# EAGLE design poe (EAGLE 6.5.0)
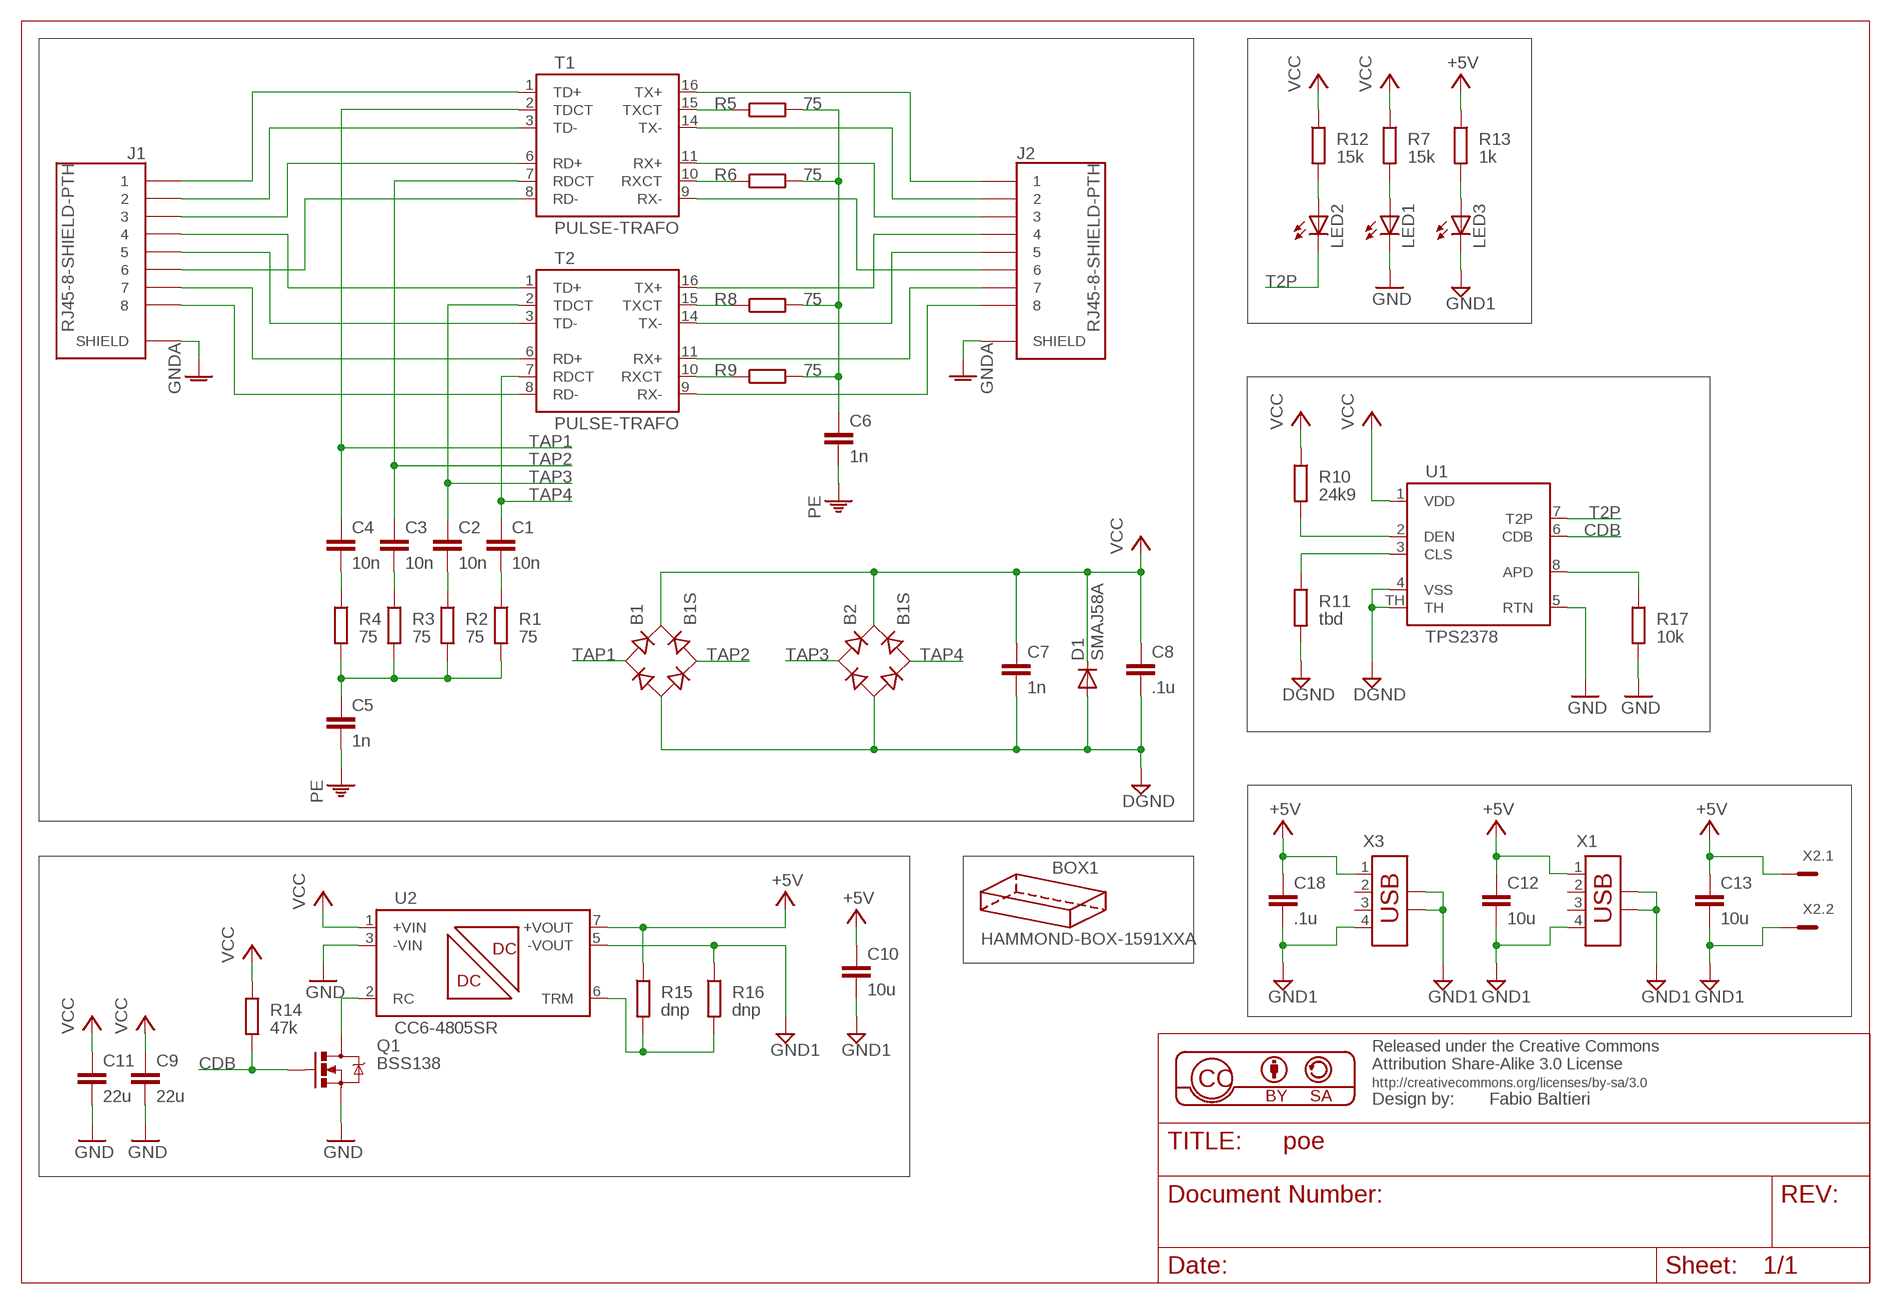
[diagram p0: schematic, sheet 1]

## Parts
B1  B1S  [MBS]
B2  B1S  [MBS]
BOX1  HAMMOND-BOX-1591XXA  [1591XXA]
C1  10n  C-EUC0603  [C0603]
C2  10n  C-EUC0603  [C0603]
C3  10n  C-EUC0603  [C0603]
C4  10n  C-EUC0603  [C0603]
C5  1n  C-EUC0603  [C0603]
C6  1n  C-EUC0603  [C0603]
C7  1n  C-EUC0603  [C0603]
C8  .1u  C-EUC0603  [C0603]
C9  22u  C-EUC1206  [C1206]
C10  10u  C-EUC0805  [C0805]
C11  22u  C-EUC1206  [C1206]
C12  10u  C-EUC0603  [C0603]
C13  10u  C-EUC0603  [C0603]
C18  .1u  C-EUC0603  [C0603]
D1  SMAJ58A  DIODESMA  [SMA-DIODE]
J1  RJ45-8-SHIELD-PTH  [RJ45-8-SHIELD]
J2  RJ45-8-SHIELD-PTH  [RJ45-8-SHIELD]
LED1  LEDSML0805  [SML0805]
LED2  LEDSML0805  [SML0805]
LED3  LEDSML0805  [SML0805]
Q1  BSS138  BSS138TRANS-00830  [SOT23-3]
R1  75  R-EU_R0603  [R0603]
R2  75  R-EU_R0603  [R0603]
R3  75  R-EU_R0603  [R0603]
R4  75  R-EU_R0603  [R0603]
R5  75  R-EU_R0603  [R0603]
R6  75  R-EU_R0603  [R0603]
R7  15k  R-EU_R0603  [R0603]
R8  75  R-EU_R0603  [R0603]
R9  75  R-EU_R0603  [R0603]
R10  24k9  R-EU_R0603  [R0603]
R11  tbd  R-EU_R0603  [R0603]
R12  15k  R-EU_R0603  [R0603]
R13  1k  R-EU_R0603  [R0603]
R14  47k  R-EU_R0603  [R0603]
R15  dnp  R-EU_R0603  [R0603]
R16  dnp  R-EU_R0603  [R0603]
R17  10k  R-EU_R0603  [R0603]
T1  PULSE-TRAFO  [PULSE-TRAFO]
T2  PULSE-TRAFO  [PULSE-TRAFO]
U1  TPS2378  [SOIC8-POWERPAD]
U2  CC6-4805SR  [CC6-XXXXSR-E]
X1  USB-787616  [USB]
X2  MC2  [MC2]
X3  USB-787616  [USB]

## Nets
+5V: C10.1 C12.1 C13.1 C18.1 R13.1 R15.1 U2.7(+VOUT) X1.1 X2.1 X3.1
CDB: Q1.1(G) R14.2 U1.6(CDB)
DGND: B1.- B2.- C7.2 C8.2 D1.A R11.2 U1.4(VSS) U1.TH
GND: C9.2 C11.2 LED1.C Q1.2(S) R17.2 U1.5(RTN) U2.3(-VIN)
GND1: C10.2 C12.2 C13.2 C18.2 LED3.C R16.1 U2.5(-VOUT) X1.4 X1.SHLD1 X1.SHLD2 X2.2 X3.4 X3.SHLD1 X3.SHLD2
GNDA: J1.P$1(SHIELD) J1.P$2(SHIELD) J2.P$1(SHIELD) J2.P$2(SHIELD)
N$1: LED1.A R7.2
N$2: LED2.A R12.2
N$3: R10.2 U1.2(DEN)
N$4: R11.1 U1.3(CLS)
N$5: J1.1 T1.1(TD+)
N$6: J1.2 T1.3(TD-)
N$7: J1.3 T1.6(RD+)
N$8: J1.6 T1.8(RD-)
N$9: J1.4 T2.1(TD+)
N$10: J1.5 T2.3(TD-)
N$11: J1.7 T2.6(RD+)
N$12: J1.8 T2.8(RD-)
N$13: C4.2 R4.1
N$14: C3.2 R3.1
N$15: C2.2 R2.1
N$16: C1.2 R1.1
N$17: C5.1 R1.2 R2.2 R3.2 R4.2
N$18: R5.1 T1.15(TXCT)
N$19: R6.1 T1.10(RXCT)
N$20: R8.1 T2.15(TXCT)
N$21: R9.1 T2.10(RXCT)
N$22: C6.1 R5.2 R6.2 R8.2 R9.2
N$23: J2.1 T1.16(TX+)
N$24: J2.2 T1.14(TX-)
N$25: J2.3 T1.11(RX+)
N$26: J2.6 T1.9(RX-)
N$27: J2.4 T2.16(TX+)
N$28: J2.5 T2.14(TX-)
N$29: J2.7 T2.11(RX+)
N$30: J2.8 T2.9(RX-)
N$31: LED3.A R13.2
N$32: Q1.3(D) U2.2(RC)
N$33: R15.2 R16.2 U2.6(TRM)
N$34: R17.1 U1.8(APD)
PE: C5.2 C6.2
T2P: LED2.C U1.7(T2P)
TAP1: B1.AC1 C4.1 T1.2(TDCT)
TAP2: B1.AC2 C3.1 T1.7(RDCT)
TAP3: B2.AC1 C2.1 T2.2(TDCT)
TAP4: B2.AC2 C1.1 T2.7(RDCT)
VCC: B1.+ B2.+ C7.1 C8.1 C9.1 C11.1 D1.C R7.1 R10.1 R12.1 R14.1 U1.1(VDD) U2.1(+VIN)
Unconnected: X1.2 X1.3 X3.2 X3.3

## Library data of the parts
B1 B2 = rectifier:B*S: Surface Mount Glass Passivated Bridge Rectifiers Source: Comchip Bridge Rectifiers B05S-G_B10S-G.pdf
BOX1 = hammond:HAMMOND-BOX: Hammond Project boxes Hammond 1551 Transluscent Blue 50x35x20mm 1551GTBU http://www.hammondmfg.com/pdf/1551G.pdf Hammond 1551 Transluscent Blue 50x50x20mm 1551RTBU http://www.hammondmfg.com/pdf/1551R.pdf Hammond 1551 Transluscent Blue 60x35x20mm 1551HTBU http://www.hammondmfg.com/pdf/1551H.pdf Hammond 1551 Transluscent Blue 80x40x20mm 1551KTBU http://www.hammondmfg.com/pdf/1551K.pdf Hammond 1591 Transluscent Blue 100x51x22m m 1591XXATBU http://www.hammondmfg.com/pdf/1591XXA.pdf
C1-C13 C18 = rcl:C-EU: CAPACITOR, European symbol
D1 = SparkFun-DiscreteSemi:DIODE: Diode These are standard reverse protection diodes and small signal diodes. SMA package can handle up to about 1A. SOD-323 can handle about 200mA. What the SOD-323 package when ordering, there are some mfgs out there that are 5-pin packages.
J1 J2 = balto:RJ45-8-SHIELD
LED1-LED3 = led:LED: LED OSRAM: - CHIPLED LG R971, LG N971, LY N971, LG Q971, LY Q971, LO R971, LY R971 LH N974, LH R974 LS Q976, LO Q976, LY Q976 LO Q996 - Hyper CHIPLED LW Q18S LB Q993, LB Q99A, LB R99A - SideLED LS A670, LO A670, LY A670, LG A670, LP A670 LB A673, LV A673, LT A673, LW A673 LH A674 LY A675 LS A676, LA A676, LO A676, LY A676, LW A676 LS A679, LY A679, LG A679 - Hyper Micro SIDELED® LS Y876, LA Y876, LO Y876, LY Y876 LT Y87S - SmartLED LW L88C, LW L88S LB L89C, LB L89S, LG L890 LS L89K, LO L89K, LY L89K LS L896, LA L896, LO L896, LY L896 - TOPLED LS T670, LO T670, LY T670, LG T670, LP T670 LSG T670, LSP T670, LSY T670, LOP T670, LYG T670 LG T671, LOG T671, LSG T671 LB T673, LV T673, LT T673, LW T673 LH T674 LS T676, LA T676, LO T676, LY T676, LB T676, LH T676, LSB T676, LW T676 LB T67C, LV T67C, LT T67C, LS T67K, LO T67K, LY T67K, LW E67C LS E67B, LA E67B, LO E67B, LY E67B, LB E67C, LV E67C, LT E67C LW T67C LS T679, LY T679, LG T679 LS T770, LO T770, LY T770, LG T770, LP T770 LB T773, LV T773, LT T773, LW T773 LH T774 LS E675, LA E675, LY E675, LS T675 LS T776, LA T776, LO T776, LY T776, LB T776 LHGB T686 LT T68C, LB T68C - Hyper Mini TOPLED® LB M676 - Mini TOPLED Santana® LG M470 LS M47K, LO M47K, LY M47K Source: http://www.osram.convergy.de LUXEON: - LUMILED® LXK2-PW12-R00, LXK2-PW12-S00, LXK2-PW14-U00, LXK2-PW14-V00 LXK2-PM12-R00, LXK2-PM12-S00, LXK2-PM14-U00 LXK2-PE12-Q00, LXK2-PE12-R00, LXK2-PE12-S00, LXK2-PE14-T00, LXK2-PE14-U00 LXK2-PB12-K00, LXK2-PB12-L00, LXK2-PB12-M00, LXK2-PB14-N00, LXK2-PB14-P00, LXK2-PB14-Q00 LXK2-PR12-L00, LXK2-PR12-M00, LXK2-PR14-Q00, LXK2-PR14-R00 LXK2-PD12-Q00, LXK2-PD12-R00, LXK2-PD12-S00 LXK2-PH12-R00, LXK2-PH12-S00 LXK2-PL12-P00, LXK2-PL12-Q00, LXK2-PL12-R00 Source: www.luxeon.com KINGBRIGHT: KA-3528ASYC Source: www.kingbright.com
Q1 = SparkFun-DiscreteSemi:BSS138: NMOSFET, Enh Mode 50V/6-ohm 200mA (SOT-23) TRANS-00830; PROD_ID: TRANS-00830
R1-R17 = rcl:R-EU_: RESISTOR, European symbol
T1 T2 = balto:PULSE-TRAFO: Pulse Transformer
U1 = balto:TPS2378: IEEE 802.3at PoE High-Power PD Interface
U2 = balto:CC6: DC-DC CONVERTER UNIT CC6-xxxxxR-E Series
X1 X3 = balto:USB-787616: AMP connector
X2 = con-phoenix-381_l:MC2: Mini-Combicon 3.81mm horizontal 2-polig MC 1,5/2-G-3,81 Artikel-Nr. 1803277

## Board
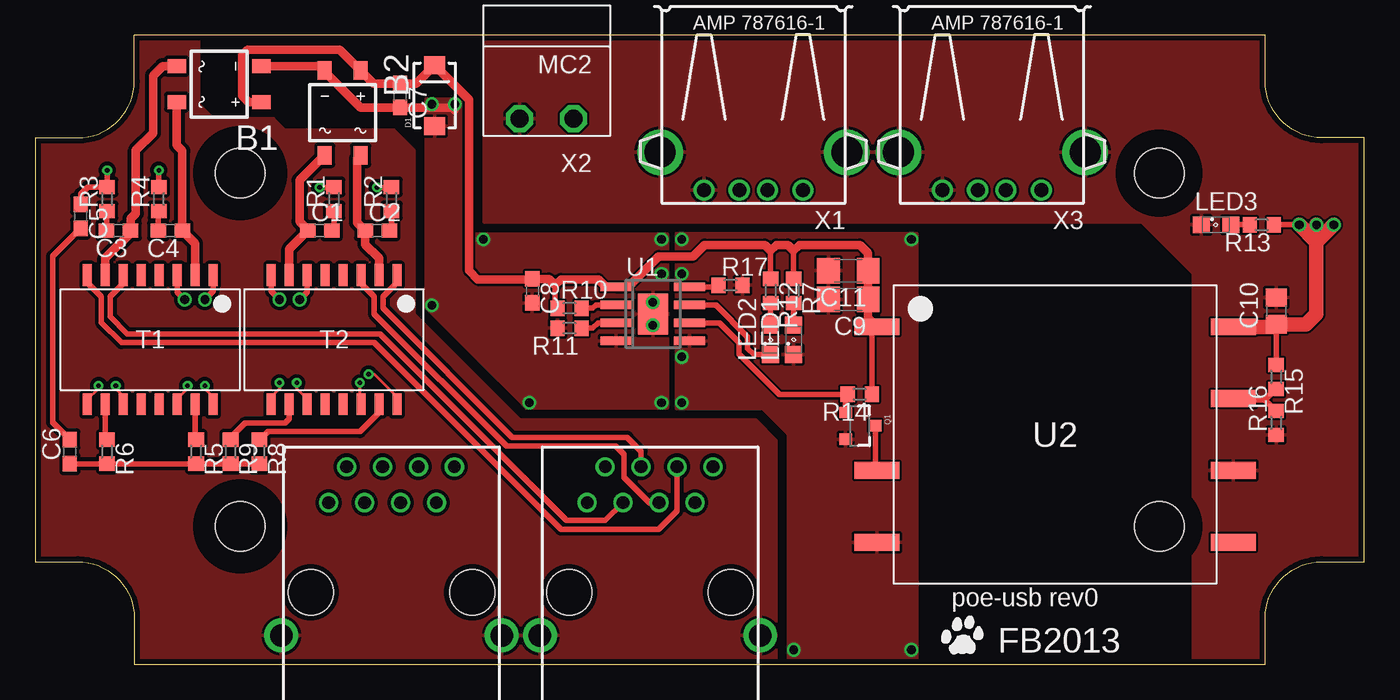
[diagram p1: board, top side]
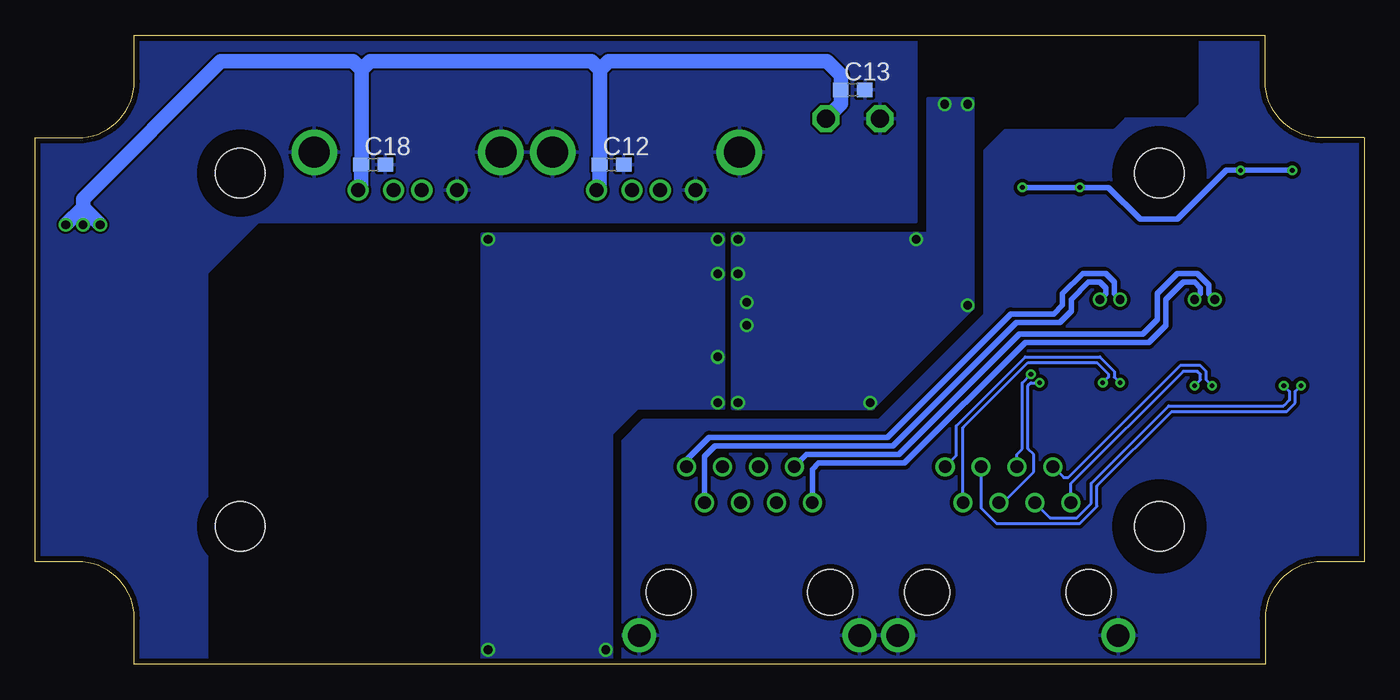
[diagram p2: board, bottom side, seen from below]

Size 94 x 44.5 mm. Coordinates in mm from the lower left corner, seen from the top.
Copper layers (1*16): Top 0.035mm / dielectric 1.5mm / Bottom 0.035mm
Design rules "balto": minimum track width 6mil, minimum drill 13mil, track to track 6mil, track to pad 6mil, pad to pad 6mil, via to via 6mil, smd to smd 6mil, copper to edge 15mil, drill to drill 6mil, minimum pad ring 7mil, minimum via ring 7mil, stop-mask expansion 2mil, vias tented up to drill 20mil, thermal gap 8mil

### Footprints (pad centres in the part's own frame; a part is rotated, then mirrored left to right if it is on the bottom)
MBS = smd 1 x 1.3: + -1.27,-3; - 1.27,-3; AC1 -1.27,3; AC2 1.27,3
1591XXA = hole 3.5: 79.5,9.75; 14.5,34.75; 79.5,34.75; 14.5,9.75
C0603 = smd 1.1 x 1: 1 -0.85,0; 2 0.85,0
C1206 = smd 1.6 x 1.8: 1 -1.4,0; 2 1.4,0
C0805 = smd 1.3 x 1.5: 1 -0.95,0; 2 0.95,0
SMA-DIODE = smd 1.27 x 1.47: A -2.15,0; C 2.15,0
RJ45-8-SHIELD = drill 0.9: 1 -4.445,6.35; 2 -3.175,8.89; 3 -1.905,6.35; 4 -0.635,8.89; 5 0.635,6.35; 6 1.905,8.89; 7 3.175,6.35; 8 4.445,8.89 | drill 1.6: P$1 7.795,-3.05; P$2 -7.795,-3.05 | hole 3.2: -5.715,0; 5.715,0
SML0805 = smd 1.2 x 1.2: A 1.05,0; C -1.05,0
SOT23-3 = smd 0.8 x 0.9: 1 -0.95,-1; 2 0.95,-1; 3 0,1.1
R0603 = smd 1 x 1.1: 1 -0.85,0; 2 0.85,0
PULSE-TRAFO = smd 0.64 x 1.525: 1 -4.445,-4.572; 2 -3.175,-4.572; 3 -1.905,-4.572; 4 -0.635,-4.572; 5 0.635,-4.572; 6 1.905,-4.572; 7 3.175,-4.572; 8 4.445,-4.572; 9 4.445,4.572; 10 3.175,4.572; 11 1.905,4.572; 12 0.635,4.572; 13 -0.635,4.572; 14 -1.905,4.572; 15 -3.175,4.572; 16 -4.445,4.572
SOIC8-POWERPAD = smd 0.6 x 2.2: 1 -1.905,-2.6; 2 -0.635,-2.6; 3 0.635,-2.6; 4 1.905,-2.6; 5 1.905,2.6; 6 0.635,2.6; 7 -0.635,2.6; 8 -1.905,2.6 | smd 2.9 x 2.1: TH 0,0
CC6-XXXXSR-E = smd 3.2 x 1.2: 1 -12.6,7.62; 2 -12.6,-2.54; 3 -12.6,-7.62; 4 12.6,-7.62; 5 12.6,-2.54; 6 12.6,2.54; 7 12.6,7.62
USB = drill 1: 1 -3.5,12.99; 2 -1,12.99; 3 1,12.99; 4 3.5,12.99 | drill 2.2: SHLD1 -6.6,10.3; SHLD2 6.6,10.3
MC2 = drill 1.27 octagon: 1 -1.905,0; 2 1.905,0

### Placement (x,y rotation side)
B1  13,41.05 90 top
B2  21.74,39.01 180 top
BOX1  0,0 0 top
C1  20.12,30.68 0 top
C2  24.18,30.68 0 top
C3  5.89,30.68 180 top
C4  9.55,30.68 180 top
C5  3.2,31.7 270 top
C6  2.44,15.04 90 top
C7  25.81,40.23 270 top
C8  35.15,26.42 270 top
C9  57.51,25.81 180 top
C10  87.78,24.99 90 top
C11  57.51,27.84 180 top
C12  53.24,35.36 0 bottom
C13  36.17,40.64 0 bottom
C18  70.1,35.36 0 bottom
D1  28.24,40.23 90 top
J1  43.48,5.08 0 top
J2  25.2,5.08 0 top
LED1  53.64,22.96 90 top
LED2  52.02,22.96 90 top
LED3  83.52,31.09 0 top
Q1  58.32,16.87 270 top
R1  21.13,32.92 90 top
R2  25.2,32.92 90 top
R3  5.08,32.92 90 top
R4  8.74,32.92 90 top
R5  11.38,15.04 270 top
R6  5.08,15.04 270 top
R7  53.64,26.42 270 top
R8  15.85,15.04 270 top
R9  13.82,15.04 270 top
R10  37.8,25.2 0 top
R11  37.8,23.77 180 top
R12  52.02,26.42 270 top
R13  86.77,31.09 180 top
R14  58.32,19.1 180 top
R15  87.78,20.32 270 top
R16  87.78,17.07 90 top
R17  49.17,26.82 0 top
T1  8.13,22.96 180 top
T2  21.13,22.96 180 top
U1  43.69,24.79 270 top
U2  72.14,16.26 0 top
U$2  [CAT-L]  65.63,1.63 0 top
X1  50.8,46.53 180 top
X2  36.17,38.61 180 top
X3  67.67,46.53 180 top

### Tracks (layer width: path | path; a pad name or v marks a point on that pad's centre or on a via)
+5V  (via drill 0.61)
  Top 0.406: R15.1 C10.1 | v89.41,31.09 R13.1
  Top 1.016: v89.41,31.09 90.63,29.87 | v90.63,31.09 90.63,29.87 | v91.85,31.09 90.63,29.87 | U2.7 87.61,23.88 C10.1 89.88,24.04 90.63,24.79 90.63,29.87
  Bottom 1.016: X2.1 37.02,39.66 C13.1 37.02,41.69 38,42.67 53.44,42.67 54.05,42.06 | 54.05,42.06 54.66,42.67 70.31,42.67 70.92,42.06 | 70.92,42.06 71.53,42.67 80.87,42.67 90.63,32.92 90.63,32.31 | 54.05,42.06 54.05,35.39 C12.1 54.09,33.75 X1.1 | 70.92,42.06 70.92,35.39 C18.1 70.95,33.75 X3.1 | 90.63,32.31 v90.63,31.09 | v89.41,31.09 90.63,32.31 | 90.63,32.31 v91.85,31.09
CDB
  Top 0.406: Q1.1 57.32,18.95 R14.2 52.63,19.1 49.78,21.95 49.78,22.76 48.39,24.16 U1.6
DGND  (via drill 0.61)
  Top 0.61: B1.- 20.17,42.32 B2.- 20.47,41.91 23,39.38 C7.2 29.5,39.38 29.67,39.22
  other vias: 44.3,18.49 44.3,30.07 31.7,30.07 34.95,18.49 28.04,25.4 28.04,39.62 29.67,39.62 44.3,27.64 43.69,23.98 43.69,25.6
  pour Top: 30.89,30.48 44.7,30.48 44.7,18.08 34.75,18.08 27.64,25.2 27.64,40.03 30.89,40.03
  pour Bottom: 30.89,30.48 44.7,30.48 44.7,18.08 34.75,18.08 27.64,25.2 27.64,40.03 30.89,40.03
GND  (via drill 0.61)
  other vias: 45.72,18.49 61.98,30.07 53.64,1.02 61.98,1.02 45.72,30.07 45.72,27.64 45.72,21.74
  pour Top: 45.31,18.08 51.41,18.08 53.24,16.26 53.24,-0.81 62.38,-0.81 62.38,30.48 45.31,30.48
  pour Bottom: 45.31,18.08 51.41,18.08 53.24,16.26 53.24,-0.81 62.38,-0.81 62.38,30.48 45.31,30.48
GND1
  pour Bottom: 31.7,31.29 78.23,31.29 81.89,27.64 81.89,-0.81 95.71,-0.81 95.71,45.72 31.7,45.72
  pour Top: 31.7,31.29 78.23,31.29 81.89,27.64 81.89,-0.81 95.71,-0.81 95.71,45.72 31.7,45.72
GNDA
  pour Top (isolate 0.254): -0.81,-0.81 52.43,-0.81 52.43,15.85 51,17.27 34.34,17.27 26.82,24.79 26.82,36.37 25.4,37.8 17.68,37.8 16.87,38.61 12.6,38.61 11.58,39.62 11.58,45.11 -0.81,45.11
  pour Bottom (isolate 0.254): -0.81,-0.81 52.43,-0.81 52.43,15.85 51,17.27 34.34,17.27 26.82,24.79 26.82,36.37 25.4,37.8 17.68,37.8 16.87,38.61 12.6,38.61 11.58,39.62 11.58,45.11 -0.81,45.11
N$1
  Top 0.406: LED1.A R7.2
N$2
  Top 0.406: LED2.A R12.2
N$3
  Top 0.406: U1.2 39.65,25.43 39.42,25.2 R10.2
N$4
  Top 0.406: U1.3 39.8,24.16 39.42,23.77 R11.1
N$5  (via drill 0.61)
  Top 0.406: T1.1 12.57,26.39 v11.99,25.81
  Bottom 0.406: J1.1 39.04,13.79 38.61,14.22 32.51,14.22 23.98,22.76 15.24,22.76 14.02,23.98 14.02,25.81 12.8,27.03 11.99,27.03 11.58,26.62 11.58,26.21 v11.99,25.81
N$6  (via drill 0.61)
  Top 0.406: T1.3 10.03,26.34 v10.57,25.81
  Bottom 0.406: J1.2 39.45,14.83 32.92,14.83 24.38,23.37 15.65,23.37 14.63,24.38 14.63,26.21 13.21,27.64 11.79,27.64 10.97,26.82 10.97,26.21 v10.57,25.81
N$7
  Top 0.406: J1.3 40.31,10.16 37.59,10.16 24.38,23.37 6.5,23.37 5.28,24.59 5.28,26.01 6.22,26.95 T1.6
N$8
  Top 0.406: J1.6 45.39,10.85 44.09,9.55 37.19,9.55 23.98,22.76 6.1,22.76 4.67,24.18 4.67,26.01 3.68,27 T1.8
N$9
  Top 0.406: J1.4 42.85,15.06 41.86,16.05 33.73,16.05 24.59,25.2 24.59,26.01 25.58,27 T2.1
N$10
  Top 0.406: J1.5 43.43,11.43 41.66,13.21 41.66,14.83 41.05,15.44 33.33,15.44 23.98,24.79 23.98,26.01 23.04,26.95 T2.3
N$11  (via drill 0.61)
  Top 0.406: T2.6 19.23,26.34 v18.69,25.81
  Bottom 0.406: J1.7 46.66,14.71 45.92,15.44 33.33,15.44 24.59,24.18 21.54,24.18 20.73,24.99 20.73,25.81 19.51,27.03 18.69,27.03 18.29,26.62 18.29,26.21 v18.69,25.81
N$12  (via drill 0.61)
  Top 0.406: T2.8 16.69,26.39 v17.27,25.81
  Bottom 0.406: J1.8 47.93,14.45 46.33,16.05 33.73,16.05 24.99,24.79 21.95,24.79 21.34,25.4 21.34,26.21 19.91,27.64 18.29,27.64 17.68,27.03 17.68,26.21 v17.27,25.81
N$13
  Top 0.406: R4.1 8.7,32.03 C4.2
N$14
  Top 0.406: R3.1 5.04,32.03 C3.2
N$15
  Top 0.406: R2.1 25.2,30.85 C2.2
N$16
  Top 0.406: R1.1 21.13,30.85 C1.2
N$17  (via drill 0.33)
  Top 0.406: C5.1 3.2,33.27 3.69,33.77 R3.2 v5.08,34.95 | R1.2 21.1,33.73 v20.12,33.73 | R2.2 25.16,33.73 v24.18,33.73 | R4.2 v8.74,34.95
  Bottom 0.406: v24.18,33.73 v20.12,33.73 18.09,33.73 15.85,31.5 13.21,31.5 9.75,34.95 v8.74,34.95 v5.08,34.95
N$18
  Top 0.406: T1.15 11.3,15.96 R5.1
N$19
  Top 0.406: T1.10 4.95,16.01 R6.1
N$20
  Top 0.406: T2.15 24.31,17.8 22.96,16.46 16.46,16.46 15.89,15.89 R8.1
N$21
  Top 0.406: T2.10 17.96,17.35 17.68,17.07 14.83,17.07 13.82,16.05 R9.1
N$22
  Top 0.406: R8.2 R9.2 R5.2 R6.2 C6.1
N$23  (via drill 0.33)
  Top 0.203: T1.16 12.57,18.92 11.99,19.51 v11.99,19.71
  Bottom 0.203: J2.1 20.75,12.78 12.8,20.73 11.79,20.73 11.58,20.52 11.58,20.12 v11.99,19.71
N$24  (via drill 0.33)
  Top 0.203: v10.77,19.71 10.77,19.51 10.03,18.77 T1.14
  Bottom 0.203: J2.2 21.26,13.21 20.93,13.21 13.01,21.13 11.58,21.13 11.18,20.73 11.18,20.12 v10.77,19.71
N$25  (via drill 0.33)
  Top 0.203: v5.69,19.71 5.69,19.51 6.22,18.97 T1.11
  Bottom 0.203: J2.3 22.23,10.36 20.32,10.36 19.3,11.38 19.3,12.8 13.82,18.29 5.69,18.29 5.28,18.69 5.28,19.3 v5.69,19.71
N$26  (via drill 0.33)
  Top 0.203: v4.47,19.71 4.47,19.51 3.68,18.72 T1.9
  Bottom 0.203: J2.6 27.1,11.05 26.01,9.96 20.12,9.96 18.9,11.18 18.9,12.6 13.61,17.88 5.49,17.88 4.88,18.49 4.88,19.3 v4.47,19.71
N$27  (via drill 0.33)
  Top 0.203: v23.57,20.52 23.98,20.52 25.58,18.92 T2.16
  Bottom 0.203: J2.4 24.56,14.86 24.18,15.24 24.18,19.91 v23.57,20.52
N$28  (via drill 0.33)
  Top 0.203: T2.14 22.96,18.46 v22.96,19.91
  Bottom 0.203: J2.5 25.55,11.43 23.37,13.61 23.37,14.83 23.77,15.24 23.77,19.71 23.57,19.91 v22.96,19.91
N$29  (via drill 0.33)
  Top 0.203: T2.11 19.23,18.77 18.49,19.51 v18.49,19.91
  Bottom 0.203: J2.7 28.37,16.74 23.77,21.34 18.9,21.34 18.09,20.52 18.09,20.32 v18.49,19.91
N$30  (via drill 0.33)
  Top 0.203: T2.9 16.69,18.92 17.27,19.51 v17.27,19.91
  Bottom 0.203: J2.8 28.85,14.76 28.85,16.87 23.98,21.74 18.69,21.74 17.68,20.73 17.68,20.32 v17.27,19.91
N$31
  Top 0.406: R13.2 LED3.A
N$32
  Top 0.406: Q1.3 59.42,13.83 U2.2
N$33
  Top 0.406: R16.2 87.75,17.92 86.97,18.69 | R15.2 87.75,19.47 86.97,18.69 | U2.6 84.84,18.69 86.97,18.69
N$34
  Top 0.406: U1.8 48.2,26.7 R17.1
PE
  Top 0.406: C6.2 1.22,17.11 1.22,28.87 C5.2
T2P
  Top 0.406: U1.7 48.13,25.43 50.39,23.16 50.39,22.35 50.83,21.91 LED2.C
TAP1
  Top 0.61: T1.2 11.3,29.78 C4.1 10.4,36.33 10.01,36.73 B1.AC1
TAP2
  Top 0.61: T1.7 4.95,28.73 6.74,30.52 C3.1 6.74,31.53 7.11,31.9 7.11,36.37 8.33,37.59 8.33,41.66 8.99,42.32 B1.AC2
TAP3
  Top 0.406: C2.1 23.33,30.52
  Top 0.61: B2.AC1 22.76,35.76 22.76,31.26 C2.1 23.33,29.7 24.31,28.73 T2.2
TAP4
  Top 0.406: C1.1 19.3,30.72
  Top 0.61: 19.18,30.59 C1.1 17.96,29.37 T2.7 | B2.AC2 18.69,34.24 18.69,31.33 19.3,30.72
VCC
  Top 0.406: R10.1 36.78,25.36 36.78,26.82 | 53.65,29.26 R7.1 | 52.02,29.26 R12.1 | R14.1 59.17,23.51 U2.1
  Top 0.61: B1.+ 15.09,39.78 14.63,40.23 14.63,43.08 15.04,43.48 21.54,43.48 B2.+ 23.94,41.08 C7.1 26.95,41.08 D1.C 30.68,39.95 30.68,27.84 31.29,27.23 35.12,27.23 C8.1 36.34,27.27 36.78,26.82 37.19,27.23 39.83,27.23 40.36,26.7 U1.1 41.94,26.7 44.09,28.85 46.53,28.85 47.35,29.67 51.61,29.67 52.02,29.26 52.43,29.67 53.24,29.67 53.65,29.26 54.05,29.67 58.32,29.67 58.91,29.08 C11.1 C9.1 58.91,24.51 U2.1

### Text on the board
_tsilk: poe-usb rev0 | FB2013